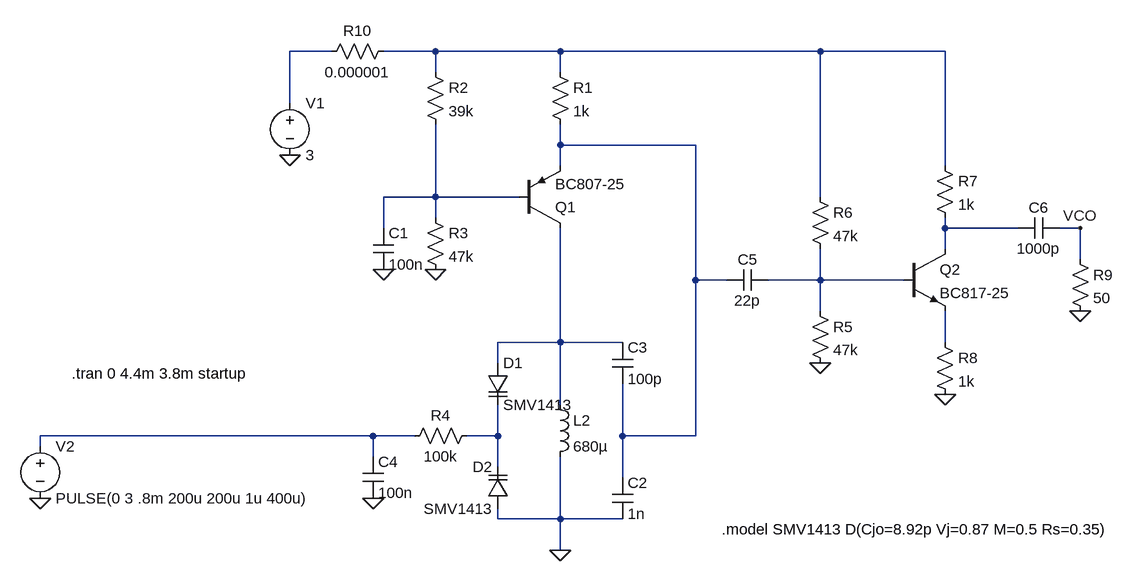
[diagram p0: schematic colpitts_220MHz.asc]
colpitts_220MHz.asc, the LTspice schematic file:
Version 4
SHEET 1 1580 680
WIRE 224 -176 160 -176
WIRE 384 -176 304 -176
WIRE 576 -176 384 -176
WIRE 976 -176 576 -176
WIRE 1168 -176 976 -176
WIRE 384 -144 384 -176
WIRE 576 -144 576 -176
WIRE 160 -96 160 -176
WIRE 576 -32 576 -64
WIRE 784 -32 576 -32
WIRE 576 0 576 -32
WIRE 1168 0 1168 -176
WIRE 384 48 384 -64
WIRE 384 48 304 48
WIRE 512 48 384 48
WIRE 976 48 976 -176
WIRE 384 80 384 48
WIRE 304 96 304 48
WIRE 1168 96 1168 80
WIRE 1280 96 1168 96
WIRE 1376 96 1344 96
WIRE 1168 128 1168 96
WIRE 1376 144 1376 96
WIRE 784 176 784 -32
WIRE 832 176 784 176
WIRE 976 176 976 128
WIRE 976 176 896 176
WIRE 1104 176 976 176
WIRE 976 224 976 176
WIRE 576 272 576 96
WIRE 576 272 480 272
WIRE 672 272 576 272
WIRE 1168 272 1168 224
WIRE 480 304 480 272
WIRE 576 368 576 272
WIRE 288 416 -224 416
WIRE 352 416 288 416
WIRE 480 416 480 368
WIRE 480 416 432 416
WIRE 672 416 672 336
WIRE 784 416 784 176
WIRE 784 416 672 416
WIRE -224 432 -224 416
WIRE 288 448 288 416
WIRE 480 464 480 416
WIRE 672 480 672 416
WIRE 480 544 480 528
WIRE 576 544 576 448
WIRE 576 544 480 544
WIRE 672 544 576 544
WIRE 576 592 576 544
FLAG 304 160 0
FLAG 384 160 0
FLAG 288 512 0
FLAG 976 304 0
FLAG 1168 352 0
FLAG 1376 224 0
FLAG -224 512 0
FLAG 1376 96 VCO
FLAG 160 -16 0
FLAG 576 592 0
SYMBOL pnp 512 96 M180
SYMATTR InstName Q1
SYMATTR Value BC807-25
SYMBOL res 560 -160 R0
SYMATTR InstName R1
SYMATTR Value 1k
SYMBOL res 368 -160 R0
SYMATTR InstName R2
SYMATTR Value 39k
SYMBOL res 368 64 R0
SYMATTR InstName R3
SYMATTR Value 47k
SYMBOL cap 288 96 R0
SYMATTR InstName C1
SYMATTR Value 100n
SYMBOL varactor 464 304 R0
SYMATTR InstName D1
SYMATTR Value SMV1413
SYMATTR Type diode
SYMBOL varactor 496 528 R180
WINDOW 0 24 64 Left 2
WINDOW 3 24 0 Left 2
SYMATTR InstName D2
SYMATTR Value SMV1413
SYMATTR Type diode
SYMBOL ind 560 352 R0
SYMATTR InstName L2
SYMATTR Value 680µ
SYMBOL cap 656 480 R0
SYMATTR InstName C2
SYMATTR Value 1n
SYMBOL cap 656 272 R0
SYMATTR InstName C3
SYMATTR Value 100p
SYMBOL res 448 400 R90
WINDOW 0 0 56 VBottom 2
WINDOW 3 32 56 VTop 2
SYMATTR InstName R4
SYMATTR Value 100k
SYMBOL cap 272 448 R0
SYMATTR InstName C4
SYMATTR Value 100n
SYMBOL cap 896 160 R90
WINDOW 0 0 32 VBottom 2
WINDOW 3 32 32 VTop 2
SYMATTR InstName C5
SYMATTR Value 22p
SYMBOL res 960 208 R0
SYMATTR InstName R5
SYMATTR Value 47k
SYMBOL res 960 32 R0
SYMATTR InstName R6
SYMATTR Value 47k
SYMBOL npn 1104 128 R0
SYMATTR InstName Q2
SYMATTR Value BC817-25
SYMBOL res 1152 -16 R0
SYMATTR InstName R7
SYMATTR Value 1k
SYMBOL res 1152 256 R0
SYMATTR InstName R8
SYMATTR Value 1k
SYMBOL cap 1344 80 R90
WINDOW 0 0 32 VBottom 2
WINDOW 3 32 32 VTop 2
SYMATTR InstName C6
SYMATTR Value 1000p
SYMBOL res 1360 128 R0
SYMATTR InstName R9
SYMATTR Value 50
SYMBOL voltage 160 -112 R0
WINDOW 123 0 0 Left 0
WINDOW 39 0 0 Left 0
SYMATTR InstName V1
SYMATTR Value 3
SYMBOL voltage -224 416 R0
WINDOW 123 0 0 Left 0
WINDOW 39 0 0 Left 0
SYMATTR InstName V2
SYMATTR Value PULSE(0 3 .8m 200u 200u 1u 400u)
SYMBOL res 320 -192 R90
WINDOW 0 0 56 VBottom 2
WINDOW 3 32 56 VTop 2
SYMATTR InstName R10
SYMATTR Value 0.000001
TEXT -176 320 Left 2 !.tran 0 4.4m 3.8m startup
TEXT 824 560 Left 2 !.model SMV1413 D(Cjo=8.92p Vj=0.87 M=0.5 Rs=0.35)

The netlist it stands for:
* colpitts_220MHz.asc
Q1 N007 N004 N003 0 BC807-25
R1 N002 N003 1k
R2 N002 N004 39k
R3 N004 0 47k
C1 N004 0 100n
D1 N007 N010 SMV1413
D2 0 N010 SMV1413
L2 N007 0 680µ
C2 N003 0 1n
C3 N007 N003 100p
R4 N010 N009 100k
C4 N009 0 100n
C5 N006 N003 22p
R5 N006 0 47k
R6 N002 N006 47k
Q2 N005 N006 N008 0 BC817-25
R7 N002 N005 1k
R8 N008 0 1k
C6 VCO N005 1000p
R9 VCO 0 50
V1 N001 0 3
V2 N009 0 PULSE(0 3 .8m 200u 200u 1u 400u)
R10 N002 N001 0.000001
.model D D
.lib standard.dio
.model NPN NPN
.model PNP PNP
.lib standard.bjt
.tran 0 4.4m 3.8m startup
.model SMV1413 D(Cjo=8.92p Vj=0.87 M=0.5 Rs=0.35)
.backanno
.end